# Altium schematic sheet log_storage.SchDoc
size Letter; DrawnBy: Robson Souza; SheetNumber: 3; SheetTotal: 9
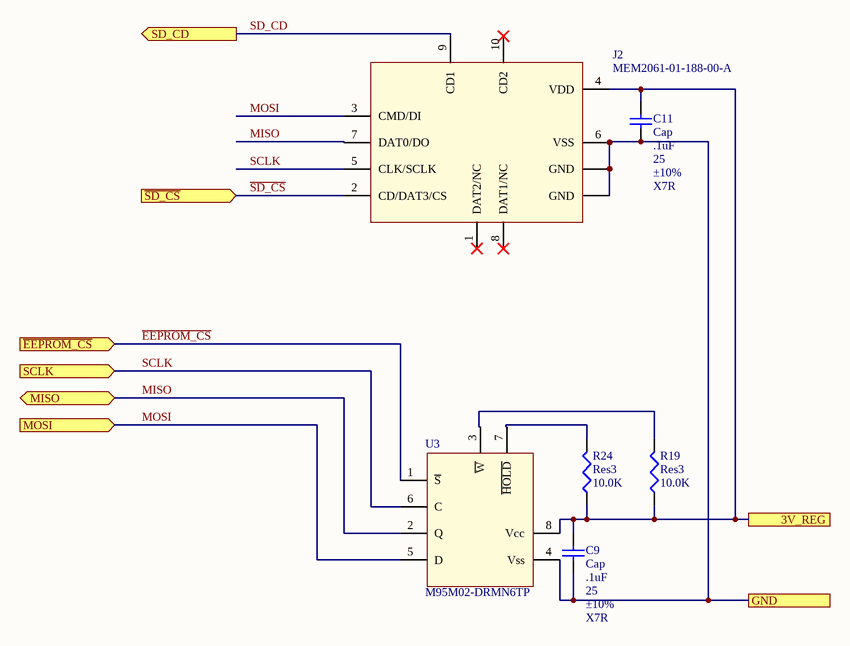
[diagram p0: log_storage.SchDoc]

## Parts
C9  Cap  value .1uF  WV: 25  Tolerance: ±10%  Type: X7R  [CAPC2012X09M]
C11  Cap  value .1uF  WV: 25  Tolerance: ±10%  Type: X7R  [CAPC2012X09M]
J2  MEM2061-01-188-00-A  [GCT_MEM2061-01-188-00-A_REVA]
R19  Res3  value 10.0K  [RESC2112X05M]
R24  Res3  value 10.0K  [RESC2112X05M]
U3  M95M02-DRMN6TP  [SOIC8-1.27-5X4MM]

## Ports
3V_REG, GND, MISO (bidir), MOSI (in), SCLK (in), SD_CD (out), ~{EEPROM_CS} (in), ~{SD_CS} (in)

## Nets
3V_REG: C9.2 C11.2 J2.4(VDD) R19.1 R24.1 U3.8(Vcc) ; port 3V_REG
~{EEPROM_CS}: U3.1(~{S}) ; port ~{EEPROM_CS}
GND: C9.1 C11.1 J2.6(VSS) J2.GND U3.4(Vss) ; port GND
MISO: J2.7(DAT0/DO) U3.2(Q) ; port MISO
MOSI: J2.3(CMD/DI) U3.5(D) ; port MOSI
~{SD_CS}: J2.2(CD/DAT3/CS) ; port ~{SD_CS}
SCLK: J2.5(CLK/SCLK) U3.6(C) ; port SCLK
SD_CD: J2.9(CD1) ; port SD_CD
NetR19_2: R19.2 U3.3(~{W})
NetR24_2: R24.2 U3.7(~{HOLD})

Not connected (* = marked no-connect by the designer): J2 1(DAT2/NC)* 8(DAT1/NC)* 10(CD2)*

## Library data of the parts
C9 C11 = CAP-X7R-.1uF-25V-±10%: CAP CER .1uF 25v X7R 0805; MPN: C0805C104K3RACTU; PN: 399-1168-1-ND; Name: CAP-X7R-.1uF-25V-±10%; URL: http://www.digikey.ca/product-detail/en/C0805C104K3RACTU/399-1168-1-ND
J2 = MEM2061-01-188-00-A_REVA: 10 _8 + 2_ Position Card Connector microSDâ„¢ Surface Mount, Right Angle Gold; MF: Global Connector Technology; SnapEDA_Link: https://www.snapeda.com/parts/MEM2061-01-188-00-A/Global%20Connector%20Technology/view-part/779219/?ref=snap; Package: None; Price: None; Value: MEM2061-01-188-00-A; Availability: Unavailable; MP: MEM2061-01-188-00-A
R19 R24 = Resistor_10.0K: RES SMD 10.0K OHM 1% 1/8W 0805; MPN: CRCW080510K0FKEA; PN: 541-10.0KCCT-ND; Name: Resistor_10.0K; URL: http://www.digikey.ca/product-detail/en/CRCW080510K0FKEA/541-10.0KCCT-ND
U3 = MCU-M95M02-DRMN6TP(SOIC8): EEPROM Memory IC 2Mb _256K x 8_ SPI 5MHz 8-SO; MF: STMicroelectronics; SnapEDA_Link: https://www.snapeda.com/parts/M95M02-DRMN6TP/STMicroelectronics/view-part/105756/?ref=snap; Availability: Unavailable; MP: M95M02-DRMN6TP; Value: M95M02-DRMN6TP; Price: None; Package: SOIC-8 STMicroelectronics